# Altium schematic sheet RTC.SchDoc
size 148 x 105 mm
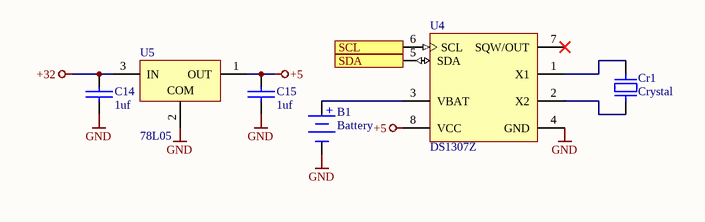
[diagram p0: RTC.SchDoc]

## Parts
B1  Battery  [20mm Coine Battery Holder]
C14  1uf  [cap_0805_A]
C15  1uf  [cap_0805_A]
Cr1  Crystal  [Crystal MC-405]
U4  DS1307Z  [SOIC_8_Maxim_M]
U5  78L05  [78L05]

## Ports
SCL, SDA

## Nets
+5: C15.1 U4.8(VCC) U5.1(OUT)
+32: C14.1 U5.3(IN)
GND: B1.2(-) C14.2 C15.2 U4.4(GND) U5.2(COM)
SCL: U4.6(SCL) ; port SCL
SDA: U4.5(SDA) ; port SDA
NetB1_1: B1.1(+) U4.3(VBAT)
NetCr1_1: Cr1.1 U4.2(X2)
NetCr1_2: Cr1.2 U4.1(X1)

Not connected (* = marked no-connect by the designer): U4 7(SQW/OUT)*

## Notes on the sheet
- Size:
- Title
- A6
- Grid units:
- mil
- Number:
- Revision:
- Date:
- Time:
- Sheet
- of

## Library data of the parts
C14 C15 = Capacitor: octopart or digikey description!; Part Number: *; Capacitance: 1uf; Voltage Rating: *
U4 = DS1307Z: 64 x 8, Serial, I2C Real-Time Clock, 5.0V, 8-Pin SO, 0 to 70 degC; ComponentLink1Description: Manufacturer URL; ComponentLink2Description: Datasheet; DatasheetVersion: 10-Feb-2008; ComponentLink3URL: http://pdfserv.maxim-ic.com/package_dwgs/21-0041.PDF; ComponentLink3Description: Package Specification; ComponentLink1URL: http://www.maxim-ic.com; Code_JEDEC: MS-012-AA; Code_IPC: SOIC127P600-8; PackageVersion: revC, 2010; PackageDescription: 8-Pin Small-Outline IC, Narrow (0.15in), 1.27 mm Pitch, SOIC (N); ComponentLink2URL: http://datasheets.maxim-ic.com/en/ds/DS1307.pdf; PackageReference: S8-2; PartNumber: DS1307Z
U5 = 78L05: Fixed Regulator with 7 to 20 V Input and 5 V Output, 0 to 125 degC, 3-Pin TO-92 (LP), Pb-Free (RoHS); PartNumber: UA78L05ACLPR; Manufacturer: Texas Instruments; Vout(Min)(V): 5; Vin(Min)(V): 7; SubFamily: Single Channel LDO; Iq(Typ)(mA): 6; Vin(Max)(V): 20; Iout(Max)(A): 0.1; Eco-Plan: Pb-Free (RoHS); ComponentLink1Description: Datasheet; ComponentLink2Description: Package Specification; DatasheetVersion: SLVS010S; ComponentLink3URL: Samples URL:http://www.ti.com/product/ua79m05#samples; ComponentLink1URL: http://www.ti.com/general/docs/lit/getliterature.tsp?genericPartNumber=UA78L05A&fileType=pdf; Code_JEDEC: TO-226-AA; ComponentLink2URL: http://www.ti.com/litv/pdf/msot002a; PackageReference: LP0003A; ComponentLink3Description: URL Link1; PackageVersion: revC, Oct-2001; Vout(Max)(V): 5; Mounting Technology: Through Hole; PackageDescription: Plastic Cylindrical Package, Formed Lead Option (TO-92)